# EAGLE design Domino USB MicroSD (EAGLE 6.5.0)
DATABASE: ./../Common/BOM/Domino_DB.txt; DRAWN: M.STEMPIN; REV: A
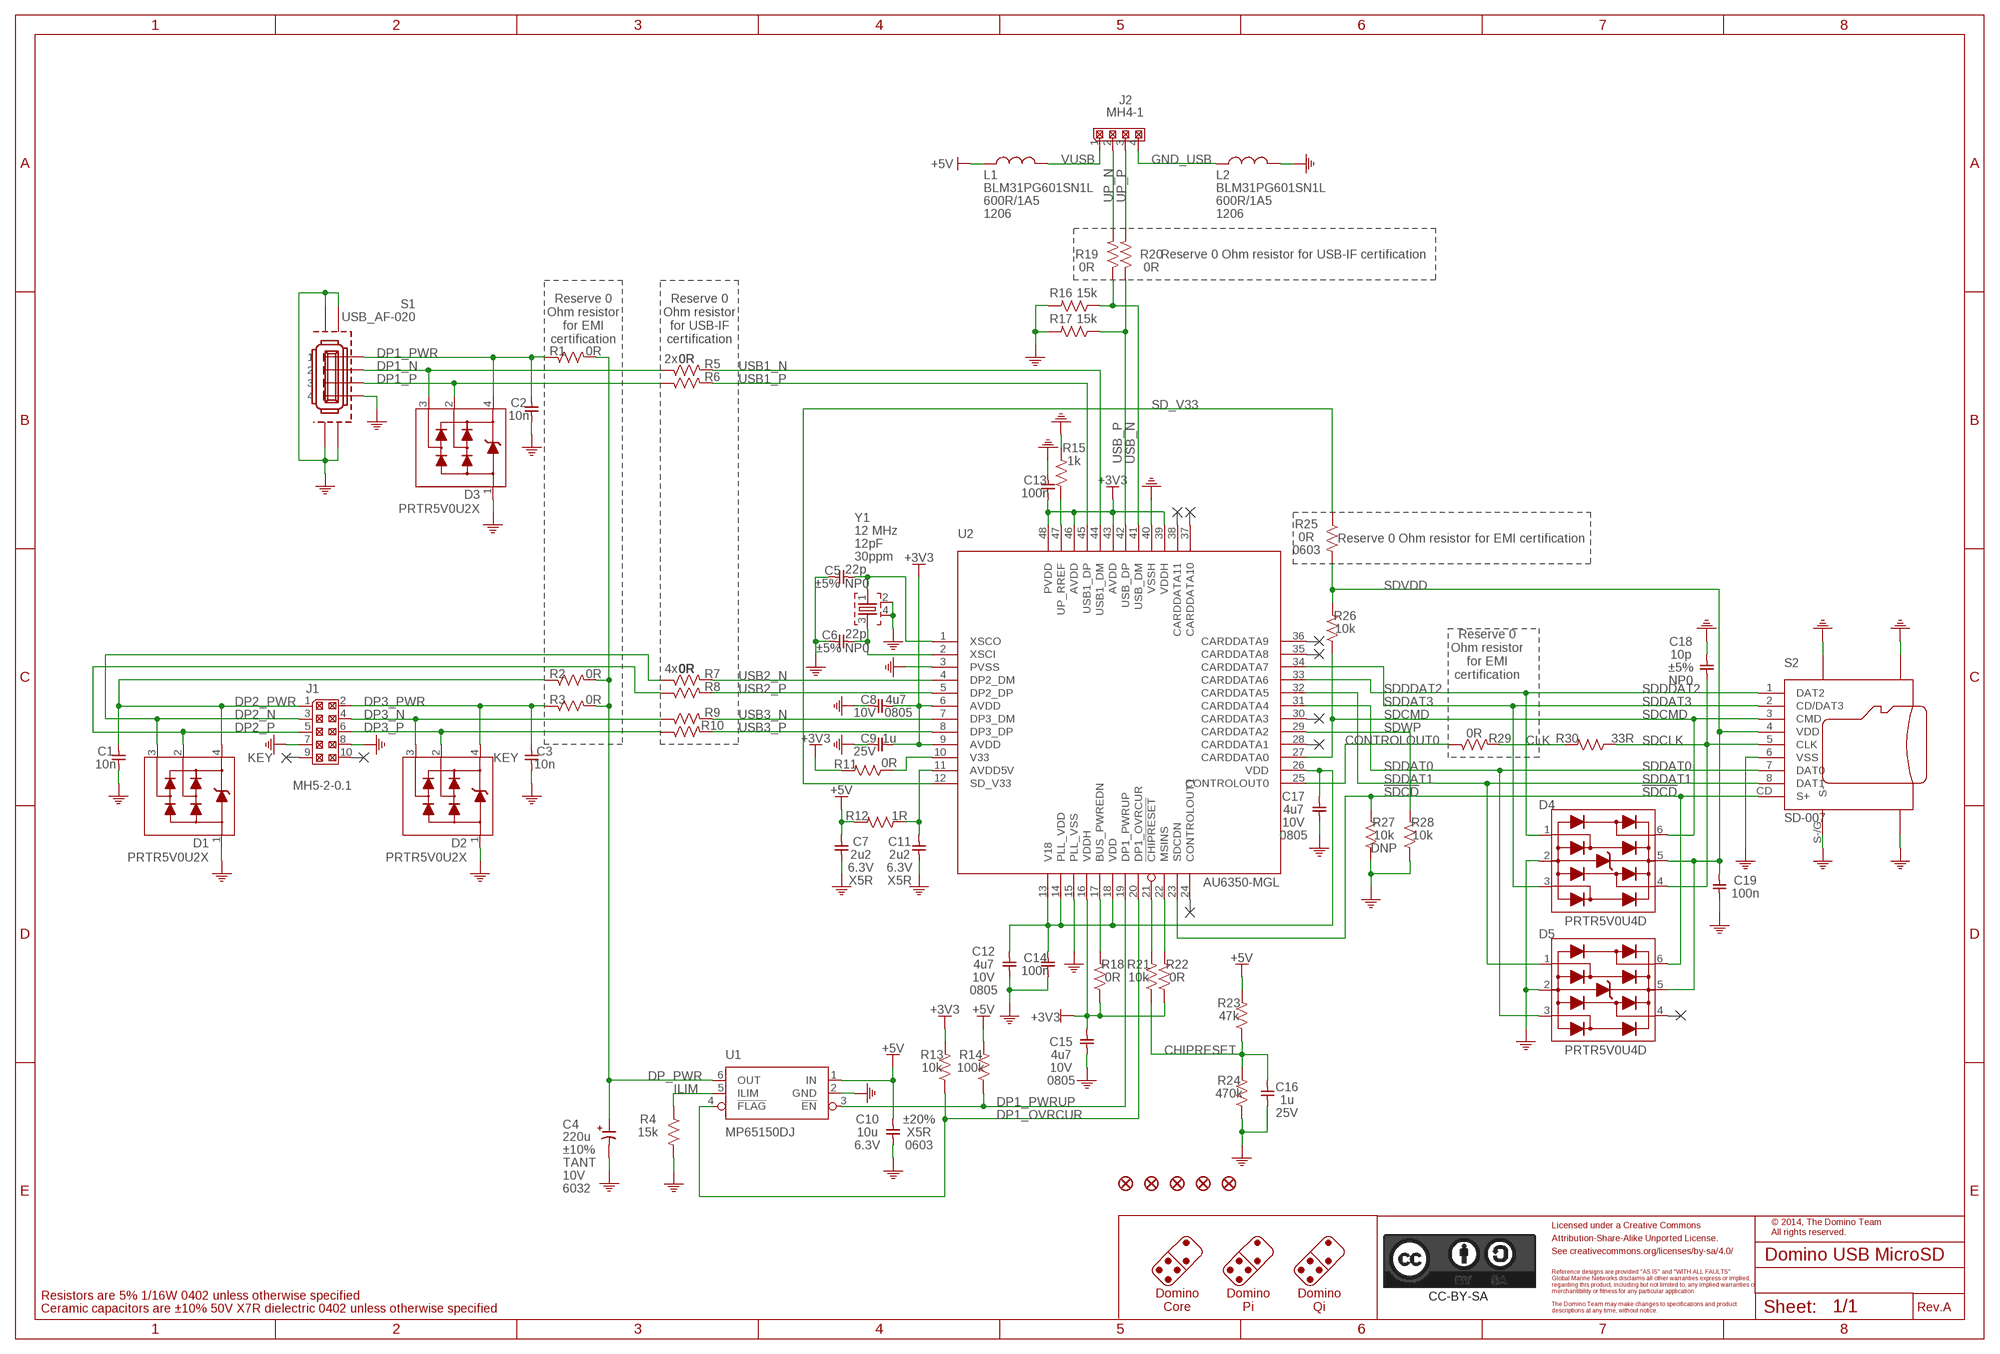
[diagram p0: schematic, sheet 1]
PORT1 (NC): BOM: EXCLUDE
PORT2 (NC): BOM: EXCLUDE
PORT3 (NC): BOM: EXCLUDE
PORT4 (NC): BOM: EXCLUDE
PORT5 (NC): BOM: EXCLUDE
PORT6 (NC): BOM: EXCLUDE
PORT7 (NC): BOM: EXCLUDE
PORT8 (NC): BOM: EXCLUDE
PORT9 (NC): BOM: EXCLUDE
PORT10 (NC): BOM: EXCLUDE

## Parts
C1  10n  CAP_0402  [C0402]
C2  10n  CAP_0402  [C0402]
C3  10n  CAP_0402  [C0402]
C4  220u  CPOL_C/6032-25  [C/6032-25]
C5  22p  CAP_0402  [C0402]
C6  22p  CAP_0402  [C0402]
C7  2u2  CAP_0402  [C0402]
C8  4u7  CAP_0805  [C0805]
C9  1u  CAP_0402  [C0402]
C10  10u  CAP_0603  [C0603]
C11  2u2  CAP_0402  [C0402]
C12  4u7  CAP_0805  [C0805]
C13  100n  CAP_0402  [C0402]
C14  100n  CAP_0402  [C0402]
C15  4u7  CAP_0805  [C0805]
C16  1u  CAP_0402  [C0402]
C17  4u7  CAP_0805  [C0805]
C18  10p  CAP_0402  [C0402]
C19  100n  CAP_0402  [C0402]
CC-BY-SA1  CC-BY-SA_LOGO  [CC-BY-SA_LOGO]
D1  PRTR5V0U2X  [SOT143B]
D2  PRTR5V0U2X  [SOT143B]
D3  PRTR5V0U2X  [SOT143B]
D4  PRTR5V0U4D  [SOT23-6]
D5  PRTR5V0U4D  [SOT23-6]
F1  FIDUCIAL  [FIDUCIAL]
F2  FIDUCIAL  [FIDUCIAL]
F4  FIDUCIAL  [FIDUCIAL]
F5  FIDUCIAL  [FIDUCIAL]
F6  FIDUCIAL  [FIDUCIAL]
J1  MH5-2-0.1  MH5-2  [MH05-2-0.1]
J2  MH4-1  [MH4-1-0.1]
L1  BLM31PG601SN1L  FB_1206  [FB1206]
L2  BLM31PG601SN1L  FB_1206  [FB1206]
R1  0R  RES_0402  [R0402]
R2  0R  RES_0402  [R0402]
R3  0R  RES_0402  [R0402]
R4  15k  RES_0402  [R0402]
R5  0R  RES_0402  [R0402]
R6  0R  RES_0402  [R0402]
R7  0R  RES_0402  [R0402]
R8  0R  RES_0402  [R0402]
R9  0R  RES_0402  [R0402]
R10  0R  RES_0402  [R0402]
R11  0R  RES_0402  [R0402]
R12  1R  RES_0402  [R0402]
R13  10k  RES_0402  [R0402]
R14  100k  RES_0402  [R0402]
R15  1k  RES_0402  [R0402]
R16  15k  RES_0402  [R0402]
R17  15k  RES_0402  [R0402]
R18  0R  RES_0402  [R0402]
R19  0R  RES_0402  [R0402]
R20  0R  RES_0402  [R0402]
R21  10k  RES_0402  [R0402]
R22  0R  RES_0402  [R0402]
R23  47k  RES_0402  [R0402]
R24  470k  RES_0402  [R0402]
R25  0R  RES_0603  [R0603]
R26  10k  RES_0402  [R0402]
R27  10k  RES_0402  [R0402]
R28  10k  RES_0402  [R0402]
R29  0R  RES_0402  [R0402]
R30  33R  RES_0402  [R0402]
S1  USB_AF-020  [USB_AF-020]
S2  SD-007  MICRO-SD  [SD-007]
U1  MP65150DJ  [SOT23-6]
U2  AU6350-MGL  [LQFP-48_7X7]
Y1  12 MHz  CRYSTAL_2SH  [CRYSTAL_32X25]

## Nets
!CHIPRESET: R21.2 U2.21(!CHIPRESET)
!SDCD: D5.6(I/O4) R27.2 S2.CD(S+) U2.23(SDCDN)
+3V3: C8.2 C9.2 C13.2 C15.2 R11.2 R13.2 R18.1 R22.1 U2.6(AVDD) U2.9(AVDD) U2.16(VDDH) U2.39(VDDH) U2.43(AVDD) U2.46(AVDD) U2.48(PVDD)
+5V: C7.1 C10.1 L1.2 R12.2 R14.2 R23.2 U1.1(IN)
AVDD5V: C11.1 R12.1 U2.11(AVDD5V)
BUS_PWREDN: R18.2 U2.17(BUS_PWREDN)
CHIPRESET: C16.1 R21.1 R23.1 R24.2
CLK: R29.2 R30.2
CONTROLOUT0: R29.1 U2.25(CONTROLOUT0)
DP1_N [USB]: D3.3 R5.1 S1.2
DP1_OVRCUR: R13.1 U1.4(!FLAG) U2.20(DP1_OVRCUR)
DP1_P [USB]: D3.2 R6.1 S1.3
DP1_PWR: C2.1 D3.4 R1.1 S1.1
DP1_PWRUP: R14.1 U1.3(!EN) U2.19(DP1_PWRUP)
DP2_N [USB]: D1.3 J1.3 R7.1
DP2_P [USB]: D1.2 J1.5 R8.1
DP2_PWR: C1.1 D1.4 J1.1 R2.1
DP3_N [USB]: D2.3 J1.4 R9.1
DP3_P [USB]: D2.2 J1.6 R10.1
DP3_PWR: C3.1 D2.4 J1.2 R3.1
DP_PWR: C4.1(+) R1.2 R2.2 R3.2 U1.6(OUT)
GND: C1.2 C2.2 C3.2 C4.2(-) C5.1 C6.1 C7.2 C8.1 C9.1 C10.2 C11.2 C12.1 C13.1 C14.2 C15.1 C16.2 C17.1 C18.2 C19.2 D1.1 D2.1 D3.1 D4.2(GND) D5.2(GND) J1.7 J1.8 L2.1 R4.2 R15.2 R16.2 R17.2 R24.1 R27.1 R28.1 S1.4 S1.G$1(G) S1.G$2(G) S1.G$3(G) S1.G$4(G) S2.6(VSS) S2.G$1(G) S2.G$2(G) S2.G$3(G) S2.S-/G(S-) U1.2(GND) U2.3(PVSS) U2.15(PLL_VSS) U2.40(VSSH) Y1.2 Y1.4
GND_USB: J2.4 L2.2
ILIM: R4.1 U1.5(ILIM)
MSINS: R22.2 U2.22(MSINS)
SD_V33: R25.1 U2.12(SD_V33)
SDCLK: C18.1 D4.4(I/O3) R30.1 S2.5(CLK)
SDCMD: D4.6(I/O4) R26.1 S2.3(CMD) U2.27(CARDDATA0)
SDDAT0: D5.3(I/O2) S2.7(DAT0) U2.31(CARDDATA4)
SDDAT1: D5.1(I/O1) S2.8(DAT1) U2.32(CARDDATA5)
SDDAT3: D4.3(I/O2) S2.2(CD/DAT3) U2.34(CARDDATA7)
SDDDAT2: D4.1(I/O1) S2.1(DAT2) U2.33(CARDDATA6)
SDVDD: C19.1 D4.5(VCC) D5.5(VCC) R25.2 R26.2 S2.4(VDD)
SDWP: R28.2 U2.29(CARDDATA2)
UP_N [USB]: J2.2 R19.2
UP_P [USB]: J2.3 R20.2
UP_PREF: R15.1 U2.47(UP_RREF)
USB1_N [USB]: R5.2 U2.44(USB1_DM)
USB1_P [USB]: R6.2 U2.45(USB1_DP)
USB2_N [USB]: R7.2 U2.4(DP2_DM)
USB2_P [USB]: R8.2 U2.5(DP2_DP)
USB3_N [USB]: R9.2 U2.7(DP3_DM)
USB3_P [USB]: R10.2 U2.8(DP3_DP)
USB_N [USB]: R16.1 R19.1 U2.41(USB_DM)
USB_P [USB]: R17.1 R20.1 U2.42(USB_DP)
V18: C12.2 C14.1 C17.2 U2.13(V18) U2.14(PLL_VDD) U2.18(VDD) U2.26(VDD)
V33: R11.1 U2.10(V33)
VUSB: J2.1 L1.1
XSCI: C6.2 U2.2(XSCI) Y1.3
XSCO: C5.2 U2.1(XSCO) Y1.1
Unconnected: D5.4(I/O3) J1.9 J1.10 U2.24(CONTROLOUT1) U2.28(CARDDATA1) U2.30(CARDDATA3) U2.35(CARDDATA8) U2.36(CARDDATA9) U2.37(CARDDATA10) U2.38(CARDDATA11)

## Notes on the sheet
- Reserve 0 Ohm resistor for USB-IF certification
- Reserve 0
  Ohm resistor
  for EMI
  certification
- Reserve 0
  Ohm resistor
  for USB-IF
  certification
- 2x
- Reserve 0 Ohm resistor for EMI certification
- Reserve 0
  Ohm resistor
  for EMI
  certification
- 4x
- KEY | KEY
- Licensed under a Creative Commons
- © 2014, The Domino Team
  All rights reserved.
- Attribution-Share-Alike Unported License.
- See creativecommons.org/licenses/by-sa/4.0/
- Reference designs are provided "AS IS" and "WITH ALL FAULTS".
- Global Marine Networks disclaims all other warranties express or implied,
- regarding this product, including but not limited to, any implied warranties of
- merchantibility or fitness for any particular application.
- Resistors are 5% 1/16W 0402 unless otherwise specified
- Domino
  Core
- Domino
  Pi
- Domino
  Qi
- The Domino Team may make changes to specifications and product
- Ceramic capacitors are ±10% 50V X7R dielectric 0402 unless otherwise specified | descriptions at any time, without notice. | Rev.

## Library data of the parts
C1-C3 = Domino:CAP_: Capacitor; PARTNO: C0402_10n_X7R_10%_CER_50V; SIZE: 0402; TC: X7R; TOL: ±10%; TYPE: CER; VOLT: 50V
C4 = Domino:CPOL_?*: Polarized Capacitor; PARTNO: CPOLC-6032_220u_20%_TANT_10V; SIZE: 6032; TOL: ±10%; TYPE: TANT; VOLT: 10V
C5 C6 = Domino:CAP_: Capacitor; PARTNO: C0402_22p_NP0_5%_CER_50V; SIZE: 0402; TC: NP0; TOL: ±5%; TYPE: CER; VOLT: 50V
C7 C11 = Domino:CAP_: Capacitor; PARTNO: C0402_2u2_X5R_10%_CER_6V3; SIZE: 0402; TC: X5R; TOL: ±10%; TYPE: CER; VOLT: 6.3V
C8 C12 C15 C17 = Domino:CAP_: Capacitor; PARTNO: C0805_4u7_X7R_10%_CER_6V3; SIZE: 0805; TC: X7R; TOL: 10%; TYPE: CER; VOLT: 10V
C9 C16 = Domino:CAP_: Capacitor; PARTNO: C0402_1u_X7R_10%_CER_25V; SIZE: 0402; TC: X7R; TOL: ±10%; TYPE: CER; VOLT: 25V
C10 = Domino:CAP_: Capacitor; PARTNO: C0603_10u_X5R_20%_CER_6V3; SIZE: 0603; TC: X5R; TOL: ±20%; TYPE: CER; VOLT: 6.3V
C13 C14 C19 = Domino:CAP_: Capacitor; PARTNO: C0402_100n_X7R_10%_CER_50V; SIZE: 0402; TC: X7R; TOL: ±10%; TYPE: CER; VOLT: 50V
C18 = Domino:CAP_: Capacitor; PARTNO: C0402_10p_NP0_5%_CER_50V; SIZE: 0402; TC: NP0; TOL: ±5%; TYPE: CER; VOLT: 50V
CC-BY-SA1 = Domino:CC-BY-SA_LOGO: Attribution-Share-Alike Unported License See creativecommons.org/licenses/by-sa/3.0/ for details.; BOM: EXCLUDE
D1-D3 = Domino:PRTR5V0U2X: Ultra low capacitance double rail-to-rail ESD protection diode; PARTNO: PRTR5V0U2X
D4 D5 = Domino:PRTR5V0U4D: Ultra low capacitance quadruple rail-to-rail ESD protection; PARTNO: PRTR5V0U4D
F1 F2 F4-F6 = Domino:FIDUCIAL: Fiducial Mark; BOM: EXCLUDE
J1 = Domino:MH5-2: 2x5 Pin Male Header; PARTNO: MH5-2-0.1
J2 = Domino:MH4-1: 4x1 Pin Male Header; PARTNO: MH4-1-0.1
L1 L2 = Domino:FB_: Ferrite Bead; OPT: 600R/1A5; PARTNO: BLM31PG601SN1L; SIZE: 1206
R1-R3 R5-R10 R18-R20 R22 R29 = Domino:RES_: Resistor; PARTNO: R0402_0R_5%_62.5mW; RATE: 62.5mW; SIZE: 0402; TOL: 5%
R4 R16 R17 = Domino:RES_: Resistor; PARTNO: R0402_15k_5%_62.5mW; RATE: 62.5mW; SIZE: 0402; TOL: 5%
R11 = Domino:RES_: Resistor; PARTNO: R0402_0R_5%_62.5mW; RATE: 125mW; SIZE: 0402; TOL: 5%
R12 = Domino:RES_: Resistor; PARTNO: R0402_1R_5%_62.5mW; RATE: 62.5mW; SIZE: 0402; TOL: 5%
R13 R21 R26 R28 = Domino:RES_: Resistor; PARTNO: R0402_10k_5%_62.5mW; RATE: 62.5mW; SIZE: 0402; TOL: 5%
R14 = Domino:RES_: Resistor; PARTNO: R0402_100k_5%_62.5mW; RATE: 62.5mW; SIZE: 0402; TOL: 5%
R15 = Domino:RES_: Resistor; PARTNO: R0402_1k_5%_62.5mW; RATE: 62.5mW; SIZE: 0402; TOL: 5%
R23 = Domino:RES_: Resistor; PARTNO: R0402_47k_5%_62.5mW; RATE: 62.5mW; SIZE: 0402; TOL: 5%
R24 = Domino:RES_: Resistor; PARTNO: R0402_470k_5%_62.5mW; RATE: 62.5mW; SIZE: 0402; TOL: 5%
R25 = Domino:RES_: Resistor; PARTNO: R0603_0R_5%_125mW; RATE: 125mW; SIZE: 0603; TOL: 5%
R27 = Domino:RES_: Resistor; DNP: T; PARTNO: R0402_10k_5%_62.5mW; RATE: 62.5mW; SIZE: 0402; TOL: 5%
R30 = Domino:RES_: Resistor; PARTNO: R0402_33R_5%_62.5mW; RATE: 62.5mW; SIZE: 0402; TOL: 5%
S1 = Domino:USB_AF-020: USB Type A Socket; PARTNO: USB_AF-020
S2 = Domino:MICRO-SD: Micro SD Memory Card Connector, With Card Detect Switch; PARTNO: SD-007
U1 = Domino:MP65150DJ: Precision 60mA-1.7A Programmable Current-Limited Power Distribution Switch; PARTNO: MP65150DJ
U2 = Domino:AU6350-MGL: USB2.0 Hub-Reader Controller; PARTNO: AU6350-MGL
Y1 = Domino:CRYSTAL_2SH: Crystal with 2 Shield Pins; LOAD: 12pF; PARTNO: CRYSTAL_32X25_2SH_12PF_30PPM; TOL: 30ppm

## Net classes
1 USB: width 0.368 mm, clearance 0.152 mm to class 0, clearance 0.152 mm
2 PoE: width 0.61 mm, clearance 0.13 mm to class 0, clearance 0.13 mm to class 1, clearance 0.13 mm

## Board
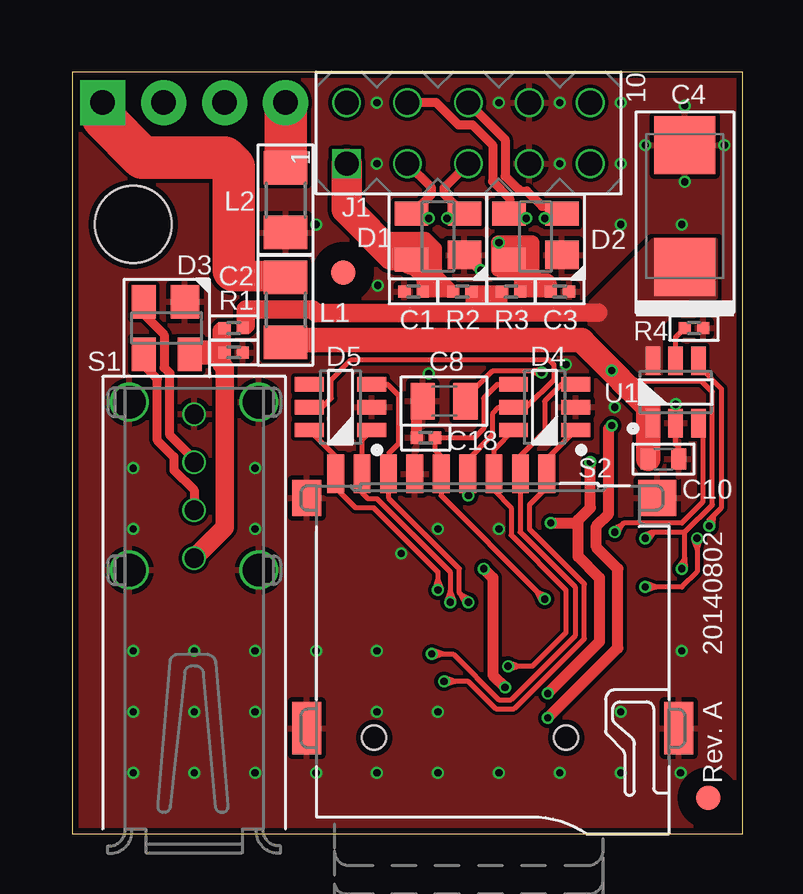
[diagram p1: board, top side]
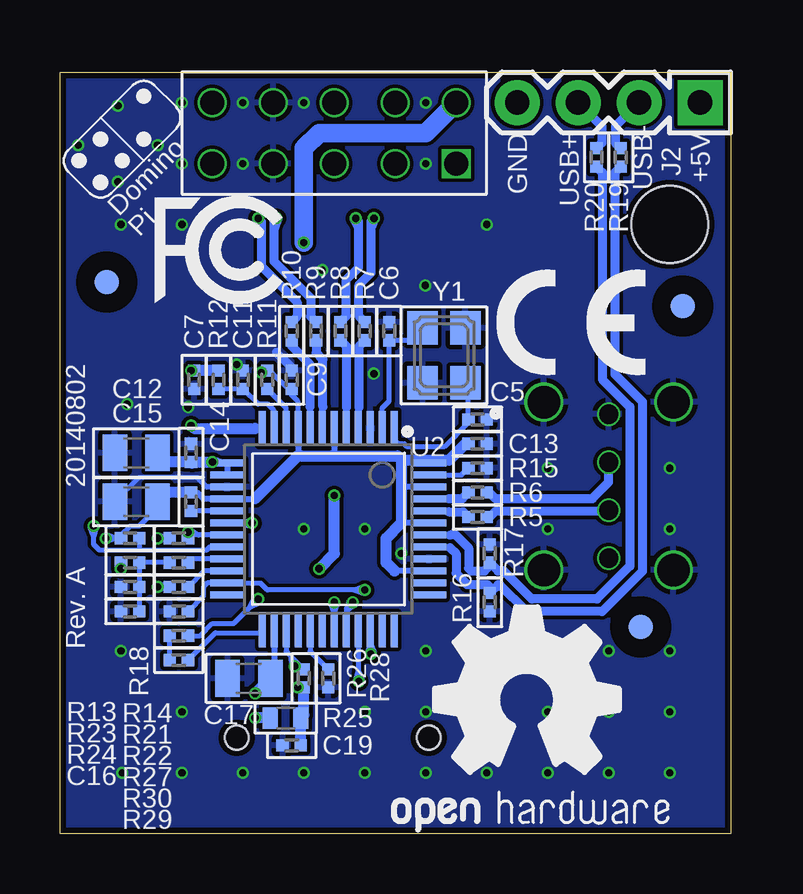
[diagram p2: board, bottom side, seen from below]

Size 27.94 x 31.75 mm. Coordinates in mm from the lower left corner, seen from the top.
Outline: 0,0 27.94,0 27.94,31.75 0,31.75 0,0
Copper layers (1*16): Top 0.043mm / dielectric 1mm / Bottom 0.043mm
Design rules "Domino": minimum track width 0.1mm, minimum drill 0.3mm, track to track 6mil, track to pad 6mil, pad to pad 6mil, via to via 6mil, smd to smd 0mil, copper to edge 0.25mm, drill to drill 0.35mm, minimum pad ring 0.085mm, minimum via ring 0.1mm, stop-mask expansion 0mil, vias tented up to drill 0.45mm, thermal gap 0.2mm
Holes 3.2 mm at 2.54,25.4

### Footprints (pad centres in the part's own frame; a part is rotated, then mirrored left to right if it is on the bottom)
C0402 = smd 0.508 x 0.508: 1 -0.381,0; 2 0.381,0
C/6032-25 = smd 2.413 x 2.54: 1 -2.54,0; 2 2.54,0
C0805 = smd 1.016 x 1.524: 1 -0.889,0; 2 0.889,0
C0603 = smd 0.635 x 0.889: 1 -0.635,0; 2 0.635,0
SOT143B = smd 1.2 x 1.4: 1 -0.76,-1.1 | smd 1 x 1.4: 2 0.96,-1.1; 3 0.96,1.1; 4 -0.96,1.1
SOT23-6 = smd 0.6 x 1.2: 1 -0.95,-1.3; 2 0,-1.3; 3 0.95,-1.3; 4 0.95,1.3; 5 0,1.3; 6 -0.95,1.3
FIDUCIAL = smd 1.016 x 1.016: 1 0,0
MH05-2-0.1 = drill 1 square: 1 -1.27,5.08 | drill 1: 2 1.27,5.08; 3 -1.27,2.54; 4 1.27,2.54; 5 -1.27,0; 6 1.27,0; 7 -1.27,-2.54; 8 1.27,-2.54; 9 -1.27,-5.08; 10 1.27,-5.08
MH4-1-0.1 = drill 1.016 pad 1.88 square: 1 0,0 | drill 1.016 pad 1.88: 2 2.54,0; 3 5.08,0; 4 7.62,0
FB1206 = smd 1.4 x 1.8: 1 -1.35,0; 2 1.35,0
R0402 = smd 0.508 x 0.508: 1 -0.381,0; 2 0.381,0
R0603 = smd 0.635 x 0.889: 1 -0.635,0; 2 0.635,0
USB_AF-020 = drill 0.8: 1 0,2.6; 2 0,4.6; 3 0,6.6; 4 0,8.6 | drill 1.35: G$1 -2.7,2.1; G$2 2.7,2.1; G$3 2.7,9.1; G$4 -2.7,9.1
SD-007 = smd 0.7 x 1.6: 1 2.25,15; 2 1.15,15; 3 0.05,15; 4 -1.05,15; 5 -2.15,15; 6 -3.25,15; 7 -4.35,15; 8 -5.45,15; CD -6.55,15 | smd 1.6 x 1.5: G$1 6.85,14 | smd 1.2 x 2.2: G$2 7.75,4.4; G$3 -7.75,4.4 | smd 1.2 x 1.5: S-/G -7.75,14 | hole 1: -4.95,4; 3.05,4
LQFP-48_7X7 = smd 1.45 x 0.3: 1 -4.2,2.75; 2 -4.2,2.25; 3 -4.2,1.75; 4 -4.2,1.25; 5 -4.2,0.75; 6 -4.2,0.25; 7 -4.2,-0.25; 8 -4.2,-0.75; 9 -4.2,-1.25; 10 -4.2,-1.75; 11 -4.2,-2.25; 12 -4.2,-2.75; 25 4.2,-2.75; 26 4.2,-2.25; 27 4.2,-1.75; 28 4.2,-1.25; 29 4.2,-0.75; 30 4.2,-0.25; 31 4.2,0.25; 32 4.2,0.75; 33 4.2,1.25; 34 4.2,1.75; 35 4.2,2.25; 36 4.2,2.75 | smd 0.3 x 1.45: 13 -2.75,-4.2; 14 -2.25,-4.2; 15 -1.75,-4.2; 16 -1.25,-4.2; 17 -0.75,-4.2; 18 -0.25,-4.2; 19 0.25,-4.2; 20 0.75,-4.2; 21 1.25,-4.2; 22 1.75,-4.2; 23 2.25,-4.2; 24 2.75,-4.2; 37 2.75,4.2; 38 2.25,4.2; 39 1.75,4.2; 40 1.25,4.2; 41 0.75,4.2; 42 0.25,4.2; 43 -0.25,4.2; 44 -0.75,4.2; 45 -1.25,4.2; 46 -1.75,4.2; 47 -2.25,4.2; 48 -2.75,4.2
CRYSTAL_32X25 = smd 1.27 x 1.397: 1 -0.889,1.143; 2 -0.889,-1.143; 3 0.889,-1.143; 4 0.889,1.143

### Placement (x,y rotation side)
C1  14.22,22.61 180 top
C2  6.73,20.07 0 top
C3  20.32,22.61 0 top
C4  25.53,26.16 90 top
C5  10.54,17.27 180 bottom
C6  14.22,20.95 270 bottom
C7  22.35,18.92 270 bottom
C8  15.49,18.03 0 top
C9  18.29,18.92 270 bottom
C10  24.64,15.62 0 top
C11  20.32,18.92 90 bottom
C12  24.77,15.88 0 bottom
C13  10.54,16.26 180 bottom
C14  22.48,15.88 90 bottom
C15  24.77,13.84 0 bottom
C16  25.02,9.27 180 bottom
C17  20.07,6.48 0 bottom
C18  14.73,16.51 180 top
C19  18.29,3.68 180 bottom
CC-BY-SA1  -5.08,-50.8 0 top  (outside the outline)
D1  15.24,24.89 90 top
D2  19.3,24.89 90 top
D3  3.94,21.08 180 top
D4  19.68,17.78 90 top
D5  11.18,17.78 90 top
DRILEGEND  [DRILEGEND]  81.53,59.94 0 top  (outside the outline)
F1  26.5,1.5 0 top
F2  11.3,23.4 0 top
F4  3.75,8.62 0 bottom
F5  2,22 0 bottom
F6  26,23 0 bottom
J1  16.51,29.21 90 top
J2  1.27,30.48 180 bottom
L1  8.89,21.84 270 top
L2  8.89,26.42 90 top
R1  6.73,21.08 0 top
R2  16.26,22.61 0 top
R3  18.29,22.61 180 top
R4  25.91,21.08 0 top
R5  10.54,13.21 180 bottom
R6  10.54,14.22 180 bottom
R7  15.24,20.95 270 bottom
R8  16.26,20.95 270 bottom
R9  17.27,20.95 270 bottom
R10  18.29,20.95 270 bottom
R11  19.3,18.92 90 bottom
R12  21.34,18.92 90 bottom
R13  25.02,12.32 180 bottom
R14  22.99,12.32 180 bottom
R15  10.54,15.24 0 bottom
R16  10.03,9.65 270 bottom
R17  10.03,11.68 90 bottom
R18  22.48,13.84 270 bottom
R19  4.57,28.19 90 bottom
R20  5.59,28.19 90 bottom
R21  22.99,11.3 0 bottom
R22  22.99,10.29 0 bottom
R23  25.02,11.3 180 bottom
R24  25.02,10.29 0 bottom
R25  18.54,4.83 0 bottom
R26  17.78,6.48 270 bottom
R27  22.99,9.27 0 bottom
R28  16.76,6.48 90 bottom
R29  22.99,7.24 180 bottom
R30  22.99,8.26 180 bottom
S1  5.08,8.89 0 top
S2  17.53,0 0 top
U1  25.15,18.41 0 top
U2  16.76,12.7 270 bottom
U$3  [A5L-LOC]  -55.88,-62.23 0 top  (outside the outline)
U$4  [DOMINO_LOGO_SMALL]  25.35,28.95 0 bottom
U$13  [CE_LOGO_SMALL]  9.75,19.11 0 bottom
U$15  [FCC_LOGO_SMALL]  24,22.13 0 bottom
U$16  [OPEN_HARDWARE_LOGO]  8.5,5.5 0 bottom
Y1  11.94,19.94 180 bottom

### Tracks (layer width: path | path; a pad name or v marks a point on that pad's centre or on a via)
!CHIPRESET
  Bottom 0.203: U2.21 22.46,11.45 R21.2
!SDCD  (via drill 0.3 pad 0.03)
  Top 0.203: 15.24,10.61 15.24,10.92 12.57,13.59 11.81,13.59 10.98,14.42 S2.CD 10.98,15.73 D5.6 | 15.24,10.61 v15.24,10.16 | 15.24,10.61 15.1,10.21 v15.24,10.16 | 15.24,10.61 15.38,10.21 v15.24,10.16
  Bottom 0.203: U2.23 21.81,10.45 21.97,10.29 21.97,9.91 R27.2 | 20.93,10.41 U2.23 | v15.24,10.16 15.69,10.16 | 15.69,10.16 19.3,10.16 19.59,10.45 U2.23 | 15.69,10.16 15.29,10.3 v15.24,10.16 | 15.69,10.16 15.29,10.02 v15.24,10.16
+3V3  (via drill 0.3 pad 0.03)
  Top 0.203: v26.04,12.32 26.04,11.87 | 26.04,11.87 26.04,10.92 25.4,10.29 24.33,10.29 | 24.33,10.29 v23.88,10.29 | 16.38,18.16 17.53,19.3 19.11,19.3 | 19.11,19.3 19.48,19.3 v19.56,19.23 | 24.33,10.29 23.93,10.43 v23.88,10.29 | 24.33,10.29 23.93,10.15 v23.88,10.29 | 26.04,11.87 26.18,12.27 v26.04,12.32 | 26.04,11.87 25.89,12.27 v26.04,12.32 | 19.11,19.3 19.49,19.1 v19.56,19.23 | 19.11,19.3 19.53,19.37 v19.56,19.23
  Top 0.457: C8.2 16.38,18.16 16.38,18.29
  Bottom 0.203: U2.6 | 19.11,19.23 19.18,19.3 R11.2 19.48,19.3 v19.56,19.23 | 19.11,19.23 18.41,18.54 C9.2 18.29,18.29 18.01,18.01 U2.9 | R22.1 23.43,10.29 | 23.43,10.29 v23.88,10.29 | 25.59,12.32 R13.2 25.4,12.45 25.02,12.83 24.64,12.83 24,13.46 24,13.72 C15.2 | 25.59,12.32 v26.04,12.32 | 23.43,10.29 23.83,10.15 v23.88,10.29 | 23.43,10.29 23.83,10.43 v23.88,10.29 | 25.59,12.32 25.99,12.18 v26.04,12.32 | 25.59,12.32 25.99,12.46 v26.04,12.32 | 19.11,19.23 19.51,19.09 v19.56,19.23 | 19.11,19.23 19.51,19.37 v19.56,19.23
  Bottom 0.254: R18.1 22.23,14.22 21.95,13.95 U2.16 19.83,13.95 19.81,13.97 | 18.03,16.9 U2.9 18.01,15.86 17.91,15.75 | U2.6 16.51,15.87 16.64,15.75 | U2.46 13.72,14.45 13.72,14.35 | U2.43 13.72,12.95 | U2.39 14,10.95 | U2.48 12.56,15.57 12.57,15.58
  Bottom 0.406: 18.03,15.75 17.91,15.75 | 13.89,15.75 13.72,15.58
  Bottom 0.457: 14,10.95 14.35,11.3 14.35,12.31 13.72,12.95 | R18.1 23.5,14.22 C15.2 | 13.72,12.95 13.72,14.35 13.72,15.58 12.57,15.58 11.73,15.58 11.05,16.26 C13.2 | 19.81,13.97 18.03,15.75 | 17.91,15.75 16.64,15.75 13.89,15.75
+5V  (via drill 0.3 pad 0.03)
  Top 0.203: 25.53,12.57 26.67,13.72 26.67,18.41 26.23,18.86 23.56,18.86 23.24,18.54 | v23.88,12.32 24.13,12.57 24.25,12.57 | 24.25,12.57 25.53,12.57 | v25.4,11.05 25.53,11.18 25.53,11.48 | 25.53,11.48 25.53,12.57 | 25.53,11.48 25.28,11.13 v25.4,11.05 | 25.53,11.48 25.55,11.06 v25.4,11.05 | 24.25,12.57 23.84,12.46 v23.88,12.32 | 24.25,12.57 24,12.23 v23.88,12.32
  Top 0.457: L1.2 8.94,20.49
  Top 0.61: 24.2,17.59 U1.1 24.2,16.32 24,16.13 C10.1 24,15.49
  Top 1.016: 23.24,18.54 v22.48,19.3 21.29,20.49 21.29,20.52 21.23,20.57 8.97,20.57 L1.2 | 23.24,18.54 23.3,18.48 | 23.3,18.48 24,17.78 C10.1 | 23.24,18.54 23.3,18.54 23.3,18.48
  Bottom 0.203: R14.2 23.43,12.32 | 23.43,12.32 v23.88,12.32 | R23.2 v25.4,11.05 | 23.43,12.32 23.83,12.18 v23.88,12.32 | 23.43,12.32 23.83,12.46 v23.88,12.32
  Bottom 0.457: R12.2 C7.1 v22.48,19.3
AVDD5V
  Bottom 0.203: C11.1 R12.1 | U2.11 19.01,17.64 19.28,17.91 19.68,17.91 C11.1 | C11.1 20.32,18.52
BUS_PWREDN
  Bottom 0.203: U2.17 22.47,13.45 R18.2
CHIPRESET
  Bottom 0.203: R21.1 R23.1 R24.2 C16.1
CLK
  Bottom 0.203: R29.2 R30.2
CONTROLOUT0
  Bottom 0.203: R29.1 21.46,8.38 19.63,8.38 U2.25
DP1_N
  Top 0.368: S1.2 5.08,14.33 4.24,15.16 4.24,15.71 3.55,16.4 3.55,18.96 2.98,19.53 D3.3
  Bottom 0.368: S1.2 5.11,13.46 9.79,13.46 10.03,13.21 R5.1
DP1_OVRCUR  (via drill 0.3 pad 0.03)
  Top 0.203: U1.4 26.1,19.37 26.22,19.37 27.05,18.54 27.05,13.59 26.71,13.25 | v26.54,12.83 26.54,13.08 26.71,13.25 | 26.71,13.25 26.43,12.92 v26.54,12.83 | 26.71,13.25 26.69,12.82 v26.54,12.83
  Bottom 0.203: U2.20 21.7,11.95 21.84,11.81 24.64,11.81 | R13.1 24.64,11.81 | 24.64,11.81 26.29,11.81 26.54,12.06 26.54,12.38 | 26.54,12.38 v26.54,12.83 | 26.54,12.38 26.68,12.78 v26.54,12.83 | 26.54,12.38 26.4,12.78 v26.54,12.83
DP1_P
  Top 0.368: S1.3 5.08,15.61 4.07,16.62 4.07,19.2 3.83,19.43 3.83,20.8 2.98,21.66 D3.2
  Bottom 0.368: R6.1 10.05,14.22 9.8,13.98 5.76,13.98 5.08,14.66 S1.3
DP1_PWR
  Top 0.508: 5.09,20.18 D3.4 | C2.1 6.1,20.07 | R1.1 6.22,20.95
  Top 0.762: S1.1 6.35,12.76 6.35,19.43 6.22,19.56 6.22,19.94 6.1,20.07 6.22,20.19 6.22,20.95
  Top 1.016: 5.09,20.18 5.21,20.07 6.1,20.07
DP1_PWRUP  (via drill 0.3 pad 0.03)
  Top 0.203: 22.92,12.89 22.99,12.95 25.4,12.95 26.29,13.84 26.29,16.51 26.1,16.7 U1.3 | 22.92,12.89 v22.61,12.57 | 22.92,12.89 22.54,12.71 v22.61,12.57 | 22.92,12.89 22.74,12.51 v22.61,12.57
  Bottom 0.203: U2.19 22.17,12.45 | 22.17,12.45 22.48,12.45 R14.1 v22.61,12.57 | 22.17,12.45 22.6,12.43 v22.61,12.57 | 22.17,12.45 22.52,12.69 v22.61,12.57
DP2_N  (via drill 0.3 pad 0.03)
  Top 0.368: 14.46,25.85 D1.3 14.16,25.85 14.98,26.67 14.98,26.93 J1.3 | 14.46,25.85 14.66,25.85 v14.86,25.65 | 14.46,25.85 14.82,25.6 v14.86,25.65 | 14.46,25.85 14.88,25.72 v14.86,25.65
  Bottom 0.368: 14.98,25.22 14.98,23.39 15.49,22.88 15.49,21.58 R7.1 | 14.98,25.22 14.98,25.53 v14.86,25.65 | 14.98,25.22 14.92,25.66 v14.86,25.65 | 14.98,25.22 14.8,25.63 v14.86,25.65
DP2_P  (via drill 0.3 pad 0.03)
  Top 0.368: 16.02,25.85 D1.2 16.32,25.85 15.5,26.67 15.5,26.93 J1.5 | 16.02,25.85 15.82,25.85 v15.62,25.65 | 16.02,25.85 15.6,25.72 v15.62,25.65 | 16.02,25.85 15.66,25.6 v15.62,25.65
  Bottom 0.368: 15.5,25.22 15.5,23.6 16.01,23.09 16.01,21.58 R8.1 | 15.5,25.22 15.5,25.53 v15.62,25.65 | 15.5,25.22 15.68,25.63 v15.62,25.65 | 15.5,25.22 15.56,25.66 v15.62,25.65
DP2_PWR
  Top 0.508: 15.11,23.37 R2.1 14.86,22.61 14.61,22.86 | D1.4 14.14,23.58 14.61,23.11 | 14.61,23.11 14.86,23.37 14.86,22.99 15.24,22.61 | C1.1 14.61,22.86 | 14.61,22.86 14.61,23.11
  Top 0.61: 15.11,23.37 15.11,24.38 14.73,24.77 14.68,24.71
  Top 0.762: 14.61,24.64 14.68,24.71 13.16,24.71
  Top 1.27: J1.1 11.43,26.04 13.34,24.13 13.94,24.13 D1.4
DP3_N  (via drill 0.3 pad 0.03)
  Top 0.368: 18.52,25.85 D2.3 18.23,25.88 18.23,26.49 17.52,27.2 17.52,28.72 17.51,28.72 16.69,29.54 16.1,29.54 15.16,30.48 J1.4 | 18.52,25.85 18.73,25.85 v18.92,25.65 | 18.52,25.85 18.89,25.6 v18.92,25.65 | 18.52,25.85 18.94,25.72 v18.92,25.65
  Bottom 0.368: 19.02,25.21 19.02,23.86 17.5,22.34 17.5,21.57 R9.1 | 19.02,25.21 19.02,25.56 v18.92,25.65 | 19.02,25.21 18.99,25.66 v18.92,25.65 | 19.02,25.21 18.86,25.63 v18.92,25.65
DP3_P  (via drill 0.3 pad 0.03)
  Top 0.368: 20.09,25.85 D2.2 20.09,26.16 19.58,26.16 18.95,26.8 18.67,26.8 18.61,26.85 18.6,26.85 18.04,27.41 18.04,28.94 16.51,30.47 J1.6 | 20.09,25.85 19.88,25.85 v19.68,25.65 | 20.09,25.85 19.66,25.72 v19.68,25.65 | 20.09,25.85 19.72,25.6 v19.68,25.65
  Bottom 0.368: 19.54,25.23 19.54,23.64 18.06,22.16 18.06,21.57 R10.1 | 19.54,25.23 19.54,25.51 v19.68,25.65 | 19.54,25.23 19.74,25.62 v19.68,25.65 | 19.54,25.23 19.62,25.67 v19.68,25.65
DP3_PWR  (via drill 0.3 pad 0.03)
  Top 0.508: C3.1 R3.1 18.67,23.11 18.41,23.37 17.91,23.37 17.75,23.52 | 19.05,23.5 19.43,23.11 19.81,23.11 19.94,22.99 19.94,22.86 19.05,22.86 19.05,23.37 19.18,23.5
  Top 0.61: 19.18,23.5 19.18,24.64 v17.78,24.64 17.75,24.64 17.75,23.52 | D2.4 18.49,23.93 19.05,23.37
  Bottom 0.762: J1.2 12.7,29.21 17.14,29.21 17.78,28.57 v17.78,24.64
DP_PWR
  Top 0.457: R1.2 7.24,21.21
  Top 0.508: R3.2 R2.2 16.64,21.97 17.91,21.97 17.91,22.35 16.89,22.35 16.89,21.64 | 24.2,19.75 U1.6
  Top 0.61: 17.91,21.97 17.91,21.72
  Top 0.762: 21.91,21.72 17.91,21.72 17.9,21.71 10.17,21.71 10.03,21.84 7.24,21.84 7.24,21.21
  pour Top (no thermals): 21.59,21.21 21.59,22.1 24.26,24.77 26.8,24.77 26.8,22.35 25.65,22.35 24.51,21.21 24.51,19.18 23.75,19.18
GND  (via drill 0.3 pad 0.03)
  Top 0.203: C10.2 25.27,16.13 25.15,16.26 U1.2
  Top 0.457: C18.2 14.35,17.78 C8.1 | D1.1 16.38,24.13 v17.02,23.5
  Bottom 0.203: U2.15 21.82,14.45 22.23,14.86 24.64,14.86 C15.1
  Bottom 0.368: C9.1 18.29,19.43 18.92,20.07
  other vias: 13.72,11.68 14.86,19.18 20.57,19.56 25.15,17.91 12.7,27.94 20.32,27.94 20.32,30.48 17.78,30.48 12.7,30.48 22.86,30.48 25.53,30.35 25.4,25.4 22.86,25.4 12.73,22.86 2.54,15.24 7.62,15.24 15.24,12.7 7.62,12.7 2.54,12.7 2.54,7.62 25.4,7.62 12.7,7.62 10.16,7.62 7.62,7.62 5.08,7.62 2.54,5.08 5.08,5.08 7.62,5.08 12.7,5.08 15.24,5.08 22.86,5.08 25.35,2.54 22.86,2.54 20.32,2.54 17.78,2.54 15.24,2.54 12.7,2.54 10.16,2.54 7.62,2.54 5.08,2.54 2.54,2.54 27.18,28.7 23.88,28.7 25.53,27.18 22.86,27.94 10.16,25.4 22.61,17.78 17.78,12.7
  pour Top (rank 2): 0,31.75 27.94,31.75 27.94,0 0,0
  pour Bottom: 0,31.75 27.94,31.75 27.94,0 0,0
GND_USB
  Top 1.016: 8.89,28.07 L2.2
  Top 1.778: J2.4 8.89,28.07
ILIM
  Top 0.203: U1.5 25.15,20.7 R4.1
MSINS
  Bottom 0.203: U2.22 21.94,10.95 R22.2
SD_V33  (via drill 0.3 pad 0.03)
  Top 0.457: v19.81,4.83 22.73,7.75 22.73,11.05 21.84,11.94 21.84,12.83 22.35,13.34 22.35,16.89 v22.48,17.02
  Bottom 0.254: 19.81,16.89 19.52,16.89 U2.12
  Bottom 0.457: R25.1 v19.81,4.83 | v22.48,17.02 22.36,16.9 19.82,16.9 19.81,16.89
SDCLK  (via drill 0.3 pad 0.03)
  Top 0.203: 19.37,10.1 15.37,14.1 15.37,14.99 S2.5 15.38,15.74 15.11,16 C18.1 16.76,16.51 17.14,16.89 17.14,18.16 17.71,18.73 D4.4 | 19.37,10.1 v19.68,9.78 | 19.37,10.1 19.55,9.71 v19.68,9.78 | 19.37,10.1 19.75,9.91 v19.68,9.78
  Bottom 0.203: v19.68,9.78 20,9.46 | 20,9.46 20.7,8.76 21.59,8.76 22.1,8.26 R30.1 | 20,9.46 19.82,9.84 v19.68,9.78 | 20,9.46 19.62,9.64 v19.68,9.78
SDCMD  (via drill 0.3 pad 0.03)
  Top 0.203: 18.61,6.99 19.18,6.99 20.57,8.38 20.57,10.16 18.29,12.45 18.29,13.59 17.58,14.3 S2.3 17.58,16.02 D4.6 | 18.61,6.99 v18.16,6.99 | 18.61,6.99 18.21,7.12 v18.16,6.99 | 18.61,6.99 18.21,6.84 v18.16,6.99
  Bottom 0.203: 18.33,7.4 18.51,7.59 U2.27 18.54,8.53 | 18.33,7.4 R26.1 18.03,6.86 v18.16,6.99 | 18.33,7.4 18.05,7.08 v18.16,6.99 | 18.33,7.4 18.31,6.98 v18.16,6.99
SDDAT0  (via drill 0.3 pad 0.03)
  Top 0.203: v16.51,9.65 16.19,9.97 | 16.19,9.97 16.13,10.03 16.13,11.05 13.18,14 S2.7 13.21,15.03 13.21,15.88 13.59,16.26 13.59,18.29 13.15,18.73 D5.3 | 16.19,9.97 16.38,9.59 v16.51,9.65 | 16.19,9.97 16.57,9.79 v16.51,9.65
  Bottom 0.203: U2.31 16.51,8.76 | 16.51,8.76 16.51,9.2 | 16.51,9.2 v16.51,9.65 | U2.31 16.51,8.76 | 16.51,9.2 16.65,9.6 v16.51,9.65 | 16.51,9.2 16.37,9.6 v16.51,9.65
SDDAT1  (via drill 0.3 pad 0.03)
  Top 0.203: 15.75,10.1 15.75,10.92 12.7,13.97 12.32,13.97 12.08,14.21 S2.8 12.08,16.43 D5.1 | 15.75,10.1 v15.75,9.65 | 15.75,10.1 15.61,9.7 v15.75,9.65 | 15.75,10.1 15.89,9.7 v15.75,9.65
  Bottom 0.203: U2.32 16,8.51 16,9.28 | 16,9.28 16,9.4 v15.75,9.65 | 16,9.28 15.89,9.69 v15.75,9.65 | 16,9.28 15.66,9.53 v15.75,9.65
SDDAT3  (via drill 0.3 pad 0.03)
  Top 0.203: S2.2 18.67,15.75 19.68,16.76 19.68,18.03 20.38,18.73 D4.3 | S2.2 | S2.2 18.67,12.57 20.95,10.29 20.95,8.26 18.29,5.59 17.78,5.59 15.88,7.49 15.44,7.49 | v14.99,7.49 15.44,7.49 | 15.44,7.49 15.04,7.63 v14.99,7.49 | 15.44,7.49 15.04,7.35 v14.99,7.49
  Bottom 0.203: U2.34 15.01,7.94 | 15.01,7.94 15.01,7.52 v14.99,7.49 | 15.01,7.94 14.85,7.55 v14.99,7.49 | 15.01,7.94 15.13,7.53 v14.99,7.49
SDDDAT2  (via drill 0.3 pad 0.03)
  Top 0.203: S2.1 19.78,15.62 D4.1 | 19.81,14.96 S2.1 | 15.94,6.35 16.51,6.35 17.65,5.21 18.41,5.21 21.34,8.13 21.34,10.41 19.05,12.7 19.05,13.72 19.78,14.44 S2.1 | 15.94,6.35 v15.49,6.35 | 15.94,6.35 15.54,6.49 v15.49,6.35 | 15.94,6.35 15.54,6.21 v15.49,6.35
  Bottom 0.203: U2.33 15.51,6.8 | 15.51,6.8 15.51,6.37 v15.49,6.35 | 15.51,6.8 15.36,6.41 v15.49,6.35 | 15.51,6.8 15.64,6.39 v15.49,6.35
SDVDD  (via drill 0.3 pad 0.03)
  Top 0.203: S2.4 16.48,15.59 17.53,16.64 17.53,17.53 17.78,17.78 D4.5 18.92,17.78 20.07,18.92 20.07,19.56 19.86,19.76 11.63,19.76 10.79,18.92 10.79,18.16 10.41,17.78 D5.5
  Top 0.457: v16.51,14.1 16.48,14.13 S2.4 | v17.14,11.05 17.53,10.67 17.53,6.6 v18.03,6.1
  Bottom 0.457: C19.1 R25.2 17.78,4.95 R26.2 v18.03,6.1 | v17.14,11.05 16.51,11.68 v16.51,14.1
SDWP
  Bottom 0.203: U2.29 17.51,7.61 R28.2
UP_N
  Bottom 0.368: J2.2 4.79,29.5 4.79,28.8 R19.2
UP_P
  Bottom 0.368: J2.3 5.36,29.49 5.36,28.8 R20.2
UP_PREF
  Bottom 0.203: U2.47 11.21,14.95 R15.1
USB1_N
  Bottom 0.254: U2.44 11.77,13.45 11.75,13.43
  Bottom 0.368: 11.75,13.43 11.14,13.43 R5.2
USB1_P
  Bottom 0.254: U2.45 11.76,13.95 11.73,13.97
  Bottom 0.368: 11.73,13.97 11.17,13.97 R6.2
USB2_N
  Bottom 0.254: U2.4 15.51,17.75 15.49,17.78
  Bottom 0.368: R7.2 15.49,20.32 15.49,17.78
USB2_P
  Bottom 0.254: U2.5 16.01,17.9 16.01,17.91
  Bottom 0.368: 16.01,20.33 | 16.01,20.33 16.01,20.32 16.01,17.91 16.01,17.78 | R8.2 16.01,20.33
USB3_N
  Bottom 0.254: U2.7 17.01,17.78 16.99,17.81
  Bottom 0.368: 16.99,17.81 16.99,19.77 17.27,20.05 R9.2
USB3_P
  Bottom 0.254: U2.8 17.51,17.79
  Bottom 0.368: 17.51,17.79 17.51,19.56 18.29,20.33 R10.2
USB_N
  Bottom 0.254: U2.41 11.71,11.95 11.68,11.93
  Bottom 0.368: 11.68,11.93 11.44,11.68 11.44,10.85 10.97,10.39 10.13,10.39 10.03,10.29 R16.1 9.68,10.38 9.61,10.38 8.49,9.27 5.35,9.27 3.68,10.94 3.68,18.02 4.82,19.16 4.82,27.57 R19.1
USB_P
  Bottom 0.254: U2.42 11.69,12.45 11.68,12.45
  Bottom 0.368: 11.68,12.45 11.44,12.45 10.92,11.92 10.92,11.07 10.79,10.95 10.26,10.95 10.03,11.18 R17.1 9.68,10.95 9.44,10.95 8.27,9.79 5.57,9.79 4.2,11.16 4.2,17.8 5.34,18.94 5.34,27.57 R20.1
V18  (via drill 0.3 pad 0.03)
  Top 0.457: v19.81,5.84 21.97,8 21.97,10.67 21.08,11.56 21.08,12.83 | 21.08,12.83 21.08,13.08 21.59,13.59 v21.59,15.49 | v19.94,12.95 U2.18 21.08,12.83
  Bottom 0.203: 22.43,15.45 C14.1
  Bottom 0.254: U2.14 U2.13 21.14,15.45 | U2.26 19.01,6.64 C17.2 | v19.94,12.95 | U2.18 20.39,12.95 | 20.39,12.95 v19.94,12.95 | 21.14,15.45 21.55,15.45 v21.59,15.49 | 21.14,15.45 21.57,15.37 v21.59,15.49 | 21.14,15.45 21.55,15.61 v21.59,15.49 | 20.39,12.95 19.98,13.07 v19.94,12.95 | 20.39,12.95 19.98,12.83 v19.94,12.95
  Bottom 0.457: C14.1 23.5,15.49 C12.2 | 22.43,15.45 22.39,15.49 v21.59,15.49 | v19.81,5.84 C17.2
V33
  Bottom 0.203: U2.10 18.51,17.75 R11.1
VUSB
  Top 0.762: L1.1 8.89,23.24
  Top 1.27: 9.1,23.24 8.89,23.24 6.86,23.24 6.86,23.5 6.73,23.5
  Top 1.778: J2.1 1.27,29.84 2.92,28.19 6.35,28.19 6.73,27.81 6.73,23.5
XSCI
  Bottom 0.203: Y1.3 13.34,20.57 C6.2 14.22,18.03 14.51,17.74 U2.2
XSCO
  Bottom 0.203: 13.97,17.27 14.01,17.23 U2.1 13.97,16.86 13.97,16.38 13.84,16.26 13.59,16.26 13.46,16.13 11.94,16.13 10.92,17.14 C5.2 10.92,18.67 Y1.1

### Text on the board
bPlace: +5V | USB- | USB+ | GND
tNames: Rev. A
bNames: Rev. A
Document: DRILL CHART: TOP TO BOTTOM | LINE WIDTH IMPEDANCE CHART FOR REFERENCE | Class | USB | Type | Diff Coated Coplanar Waveguide With Ground 1B | Layer | Impedance | Trace Width | Trace Separation | Ground Separation | TOP, / BOTTOM | 90 Ohms | 14.5 mils | 6 mils | 6 mils | STACK-UP FOR REFERENCE | LAYER 1 L1 TOP | 18 UM CU + 12.5 UM PLATING (30.5 UM) | 1.061 MM+/-10% | CORE | 1.0 MM CORE FR-4 LG 135 / INCLUDING COPPER | LAYER 4 L16 BOTTOM | 18 UM CU + 12.5 UM PLATING (30.5 UM) | NOTES: | 1. PRINTED CIRCUIT BOARD MADE FROM NEMA GRADE FR-4 TG 135 EPOXY / LAMINATE WITH 18 UM COPPER PLATING AND 1 MM THICKNESS. | 2. ALL DIMENSIONS ARE GIVEN IN MILLIMETERS EXCEPT TRACE WIDTH/SPACE. | 3. CIRCUIT PATHS ARE FOR REFERENCE ONLY. | 4. HOLE SIZES SHOWN ARE FINISHED DIAMETERS AFTER PLATING. | 5. BOARD PLATED USING REFLOW OR SIMILAR METHOD. | 6. BOARD TO HAVE WHITE SOLDER MASK ON PLATED SURFACES USING WET / FILM SR100 OR SR1010 EPOXY. / EQUIVALENT WET OR DRY FILM MAY BE USED. | 7. SILKSCREEN BOARD USING BLACK INK. DISTORTION OF SILKSCREEN / IS ACCEPTABLE OVER TRACES. EPOXY INK ON PLATED LANDS IS NOT / ACCEPTABLE | 8. THE FOLLOWING INFORMATION APPLIES TO THIS BOARD: | * 2 COPPER LAYERS | * 1 MM BOARD THICKNESS | * REQUIRES TOP AND BOTTOM SIDE SILKSCREENS | © 2014, The Domino Team. / All rights reserved. | Licensed under a Creative Commons / Attribution-Share-Alike Unported License. / See creativecommons.org/licenses/by-sa/4.0/ | Reference designs are provided "AS IS" and "WITH ALL FAULTS". / The Domino Team disclaims all other warranties express or implied, / regarding this product, including but not limited to, any implied warranties of / merchantibility or fitness for any particular application. | Domino / Core | Domino / Pi | Domino / Qi | The Domino Team may make changes to specifications and product descriptions / at any time, without notice. | Rev.
DrillLegend: LAYER-STACK
DrillLegend_01-16: 01-16
DrillLegend_01-20: 01-20
Pinout: USB3_PWR | USB3- | USB3+ | GND | KEY | +5V | USB- | USB+ | GND | USB2_PWR | USB2- | USB2+ | GND | KEY | Pinout (.PIN)
Component_side: Component Side (.CMP)
Solder_side: Solder side (.SOL)
Silk_screen_CMP: Silk screen CMP (.PLC)
Silk_screen_SOL: Silk screen SOL (.PLS)
Solder_stop_mask_CMP: Solder stop mask CMP (.STC)
Solder_stop_mask_SOL: Solder stop mask SOL (.STS)
Cream_frame_CMP: Cream frame CMP (.CRC)
Cream_frame_SOL: Cream frame SOL (.CRS)
Drill_data: Drill data (.DRD)
Component_Assembly_CMP: Component Assembly CMP (.ASC)
Component_Assembly_SOL: Component Assembly SOL (.ASS)
Outline: Outline (.OLN)